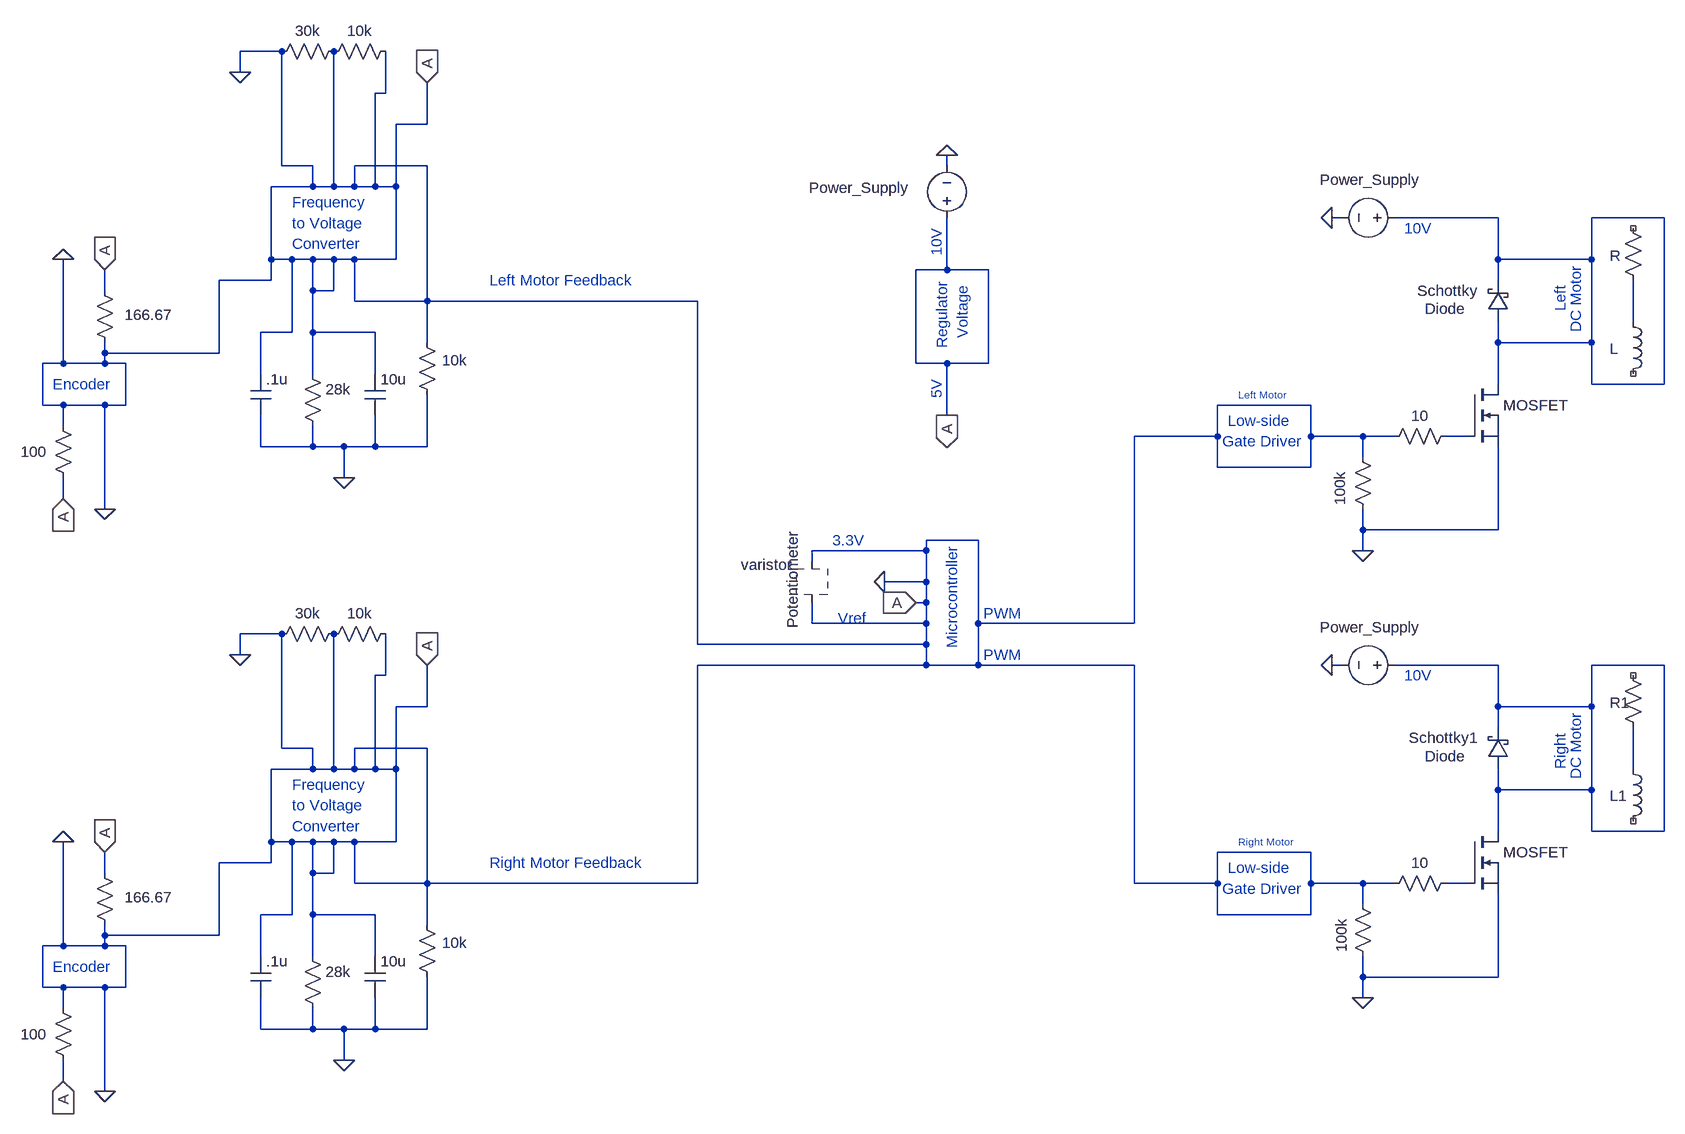
[diagram p0: schematic CircuitDiagram.asc]
CircuitDiagram.asc, the LTspice schematic file:
Version 4
SHEET 1 1300 680
WIRE -944 -1072 -1008 -1072
WIRE -1008 -1040 -1008 -1072
WIRE -784 -1008 -784 -1072
WIRE -784 -1008 -800 -1008
WIRE -720 -960 -720 -1024
WIRE -720 -960 -768 -960
WIRE -944 -896 -944 -1072
WIRE -896 -896 -944 -896
WIRE -720 -896 -832 -896
WIRE 80 -896 80 -912
WIRE -896 -864 -896 -896
WIRE -896 -864 -960 -864
WIRE -864 -864 -864 -1072
WIRE -864 -864 -896 -864
WIRE -832 -864 -832 -896
WIRE -832 -864 -864 -864
WIRE -800 -864 -800 -1008
WIRE -800 -864 -832 -864
WIRE -768 -864 -768 -960
WIRE -768 -864 -800 -864
WIRE 688 -816 672 -816
WIRE 928 -816 768 -816
WIRE 1184 -816 1072 -816
WIRE -960 -752 -960 -864
WIRE -928 -752 -960 -752
WIRE -896 -752 -928 -752
WIRE -864 -752 -896 -752
WIRE -832 -752 -864 -752
WIRE -768 -752 -768 -864
WIRE -768 -752 -832 -752
WIRE 928 -752 928 -816
WIRE 1072 -752 1072 -816
WIRE 1072 -752 928 -752
WIRE 80 -736 80 -816
WIRE 80 -736 32 -736
WIRE 144 -736 80 -736
WIRE -960 -720 -960 -752
WIRE -960 -720 -1040 -720
WIRE 928 -720 928 -752
WIRE -1216 -704 -1216 -736
WIRE -896 -704 -896 -752
WIRE -864 -704 -864 -752
WIRE -864 -704 -896 -704
WIRE -832 -688 -832 -752
WIRE -720 -688 -720 -896
WIRE -720 -688 -832 -688
WIRE -304 -688 -720 -688
WIRE 1136 -656 1136 -720
WIRE -928 -640 -928 -752
WIRE -928 -640 -976 -640
WIRE -896 -640 -896 -704
WIRE -800 -640 -896 -640
WIRE -720 -624 -720 -688
WIRE 928 -624 928 -656
WIRE 1072 -624 1072 -752
WIRE 1072 -624 928 -624
WIRE -1216 -608 -1216 -624
WIRE -1040 -608 -1040 -720
WIRE -1040 -608 -1216 -608
WIRE -1280 -592 -1280 -752
WIRE -1280 -592 -1312 -592
WIRE -1216 -592 -1216 -608
WIRE -1216 -592 -1280 -592
WIRE -1184 -592 -1216 -592
WIRE 32 -592 32 -736
WIRE 80 -592 32 -592
WIRE 144 -592 144 -736
WIRE 144 -592 80 -592
WIRE -976 -576 -976 -640
WIRE -896 -576 -896 -640
WIRE -800 -576 -800 -640
WIRE 928 -560 928 -624
WIRE 1072 -560 1072 -624
WIRE 1184 -560 1184 -816
WIRE 1184 -560 1072 -560
WIRE -1312 -528 -1312 -592
WIRE -1280 -528 -1312 -528
WIRE -1216 -528 -1280 -528
WIRE -1184 -528 -1184 -592
WIRE -1184 -528 -1216 -528
WIRE 640 -528 496 -528
WIRE 80 -512 80 -592
WIRE -1280 -496 -1280 -528
WIRE 496 -480 496 -528
WIRE 496 -480 368 -480
WIRE 640 -480 640 -528
WIRE 720 -480 640 -480
WIRE 768 -480 720 -480
WIRE 880 -480 848 -480
WIRE -976 -464 -976 -512
WIRE -896 -464 -896 -496
WIRE -896 -464 -976 -464
WIRE -848 -464 -896 -464
WIRE -800 -464 -800 -512
WIRE -800 -464 -848 -464
WIRE -720 -464 -720 -544
WIRE -720 -464 -800 -464
WIRE 720 -448 720 -480
WIRE 496 -432 496 -480
WIRE 640 -432 640 -480
WIRE 640 -432 496 -432
WIRE -848 -416 -848 -464
WIRE -1280 -384 -1280 -416
WIRE -1216 -368 -1216 -528
WIRE 720 -336 720 -368
WIRE 928 -336 928 -464
WIRE 928 -336 720 -336
WIRE 128 -320 48 -320
WIRE 48 -304 48 -320
WIRE 48 -304 -128 -304
WIRE 720 -304 720 -336
WIRE -128 -288 -128 -304
WIRE 48 -256 48 -304
WIRE 48 -256 -16 -256
WIRE 48 -224 48 -256
WIRE 48 -224 32 -224
WIRE -128 -192 -128 -224
WIRE 48 -192 48 -224
WIRE 48 -192 -128 -192
WIRE 128 -192 128 -320
WIRE 368 -192 368 -480
WIRE 368 -192 128 -192
WIRE -944 -176 -1008 -176
WIRE -304 -160 -304 -688
WIRE 48 -160 48 -192
WIRE 48 -160 -304 -160
WIRE -1008 -144 -1008 -176
WIRE 48 -128 48 -160
WIRE 48 -128 -304 -128
WIRE 128 -128 128 -192
WIRE 128 -128 48 -128
WIRE 368 -128 128 -128
WIRE 688 -128 672 -128
WIRE 928 -128 768 -128
WIRE 1184 -128 1072 -128
WIRE -784 -112 -784 -176
WIRE -784 -112 -800 -112
WIRE -720 -64 -720 -128
WIRE -720 -64 -768 -64
WIRE 928 -64 928 -128
WIRE 1072 -64 1072 -128
WIRE 1072 -64 928 -64
WIRE 928 -32 928 -64
WIRE -944 0 -944 -176
WIRE -896 0 -944 0
WIRE -720 0 -832 0
WIRE -896 32 -896 0
WIRE -896 32 -960 32
WIRE -864 32 -864 -176
WIRE -864 32 -896 32
WIRE -832 32 -832 0
WIRE -832 32 -864 32
WIRE -800 32 -800 -112
WIRE -800 32 -832 32
WIRE -768 32 -768 -64
WIRE -768 32 -800 32
WIRE 1136 32 1136 -32
WIRE 928 64 928 32
WIRE 1072 64 1072 -64
WIRE 1072 64 928 64
WIRE 928 128 928 64
WIRE 1072 128 1072 64
WIRE 1184 128 1184 -128
WIRE 1184 128 1072 128
WIRE -960 144 -960 32
WIRE -928 144 -960 144
WIRE -896 144 -928 144
WIRE -864 144 -896 144
WIRE -832 144 -864 144
WIRE -768 144 -768 32
WIRE -768 144 -832 144
WIRE 640 160 496 160
WIRE -960 176 -960 144
WIRE -960 176 -1040 176
WIRE -1216 192 -1216 160
WIRE -896 192 -896 144
WIRE -864 192 -864 144
WIRE -864 192 -896 192
WIRE -832 208 -832 144
WIRE -720 208 -720 0
WIRE -720 208 -832 208
WIRE -304 208 -304 -128
WIRE -304 208 -720 208
WIRE 368 208 368 -128
WIRE 496 208 496 160
WIRE 496 208 368 208
WIRE 640 208 640 160
WIRE 720 208 640 208
WIRE 768 208 720 208
WIRE 880 208 848 208
WIRE 720 240 720 208
WIRE -928 256 -928 144
WIRE -928 256 -976 256
WIRE -896 256 -896 192
WIRE -800 256 -896 256
WIRE 496 256 496 208
WIRE 640 256 640 208
WIRE 640 256 496 256
WIRE -720 272 -720 208
WIRE -1216 288 -1216 272
WIRE -1040 288 -1040 176
WIRE -1040 288 -1216 288
WIRE -1280 304 -1280 144
WIRE -1280 304 -1312 304
WIRE -1216 304 -1216 288
WIRE -1216 304 -1280 304
WIRE -1184 304 -1216 304
WIRE -976 320 -976 256
WIRE -896 320 -896 256
WIRE -800 320 -800 256
WIRE 720 352 720 320
WIRE 928 352 928 224
WIRE 928 352 720 352
WIRE -1312 368 -1312 304
WIRE -1280 368 -1312 368
WIRE -1216 368 -1280 368
WIRE -1184 368 -1184 304
WIRE -1184 368 -1216 368
WIRE 720 384 720 352
WIRE -1280 400 -1280 368
WIRE -976 432 -976 384
WIRE -896 432 -896 400
WIRE -896 432 -976 432
WIRE -848 432 -896 432
WIRE -800 432 -800 384
WIRE -800 432 -848 432
WIRE -720 432 -720 352
WIRE -720 432 -800 432
WIRE -848 480 -848 432
WIRE -1280 512 -1280 480
WIRE -1216 528 -1216 368
FLAG -16 -256 0
FLAG 32 -224 A
IOPIN 32 -224 In
FLAG 80 -512 A
IOPIN 80 -512 Out
FLAG 80 -912 0
FLAG 720 -304 0
FLAG 720 384 0
FLAG 672 -816 0
FLAG 672 -128 0
FLAG -1008 -1040 0
FLAG -1216 -368 0
FLAG -1280 -752 0
FLAG -1280 -384 A
IOPIN -1280 -384 In
FLAG -1216 -736 A
IOPIN -1216 -736 In
FLAG -848 -416 0
FLAG -720 -1024 A
IOPIN -720 -1024 In
FLAG -1008 -144 0
FLAG -1216 528 0
FLAG -1280 144 0
FLAG -1280 512 A
IOPIN -1280 512 In
FLAG -1216 160 A
IOPIN -1216 160 In
FLAG -848 480 0
FLAG -720 -128 A
IOPIN -720 -128 In
SYMBOL voltage 80 -800 R180
WINDOW 0 57 62 Left 2
WINDOW 3 24 -5 Left 2
SYMATTR InstName Power_Supply
SYMATTR Value ""
SYMBOL SpecialFunctions\\varistor -144 -192 R180
WINDOW 0 14 -8 VRight 2
SYMATTR InstName Potentiometer
SYMBOL res 704 -464 R0
WINDOW 0 -19 90 VLeft 2
SYMATTR InstName 100k
SYMATTR Value ""
SYMBOL res 864 -496 R90
WINDOW 0 0 56 VBottom 2
WINDOW 3 32 56 VTop 2
SYMATTR InstName 10
SYMATTR Value ""
SYMBOL res 864 192 R90
WINDOW 0 0 56 VBottom 2
WINDOW 3 32 56 VTop 2
SYMATTR InstName 10
SYMATTR Value ""
SYMBOL res 704 224 R0
WINDOW 0 -17 90 VLeft 2
SYMATTR InstName 100k
SYMATTR Value ""
SYMBOL nmos 880 -560 R0
SYMATTR InstName MOSFET
SYMATTR Value ""
SYMBOL nmos 880 128 R0
SYMATTR InstName MOSFET
SYMATTR Value ""
SYMBOL schottky 944 -656 R180
WINDOW 0 48 48 Left 2
WINDOW 3 66 20 Left 2
SYMATTR InstName Schottky
SYMATTR Value Diode
SYMBOL ind 1120 -672 R0
WINDOW 0 -20 57 Left 2
SYMATTR InstName L
SYMATTR Value ""
SYMBOL res 1120 -816 R0
WINDOW 0 -20 58 Left 2
SYMATTR InstName R
SYMATTR Value ""
SYMBOL voltage 784 -816 R90
WINDOW 0 -74 53 VTop 2
WINDOW 3 32 56 VTop 2
SYMATTR InstName Power_Supply
SYMATTR Value ""
SYMBOL schottky 944 32 R180
WINDOW 0 48 48 Left 2
WINDOW 3 66 20 Left 2
SYMATTR InstName Schottky1
SYMATTR Value Diode
SYMBOL ind 1120 16 R0
WINDOW 0 -20 57 Left 2
SYMATTR InstName L1
SYMATTR Value ""
SYMBOL res 1120 -128 R0
WINDOW 0 -20 58 Left 2
SYMATTR InstName R1
SYMATTR Value ""
SYMBOL voltage 784 -128 R90
WINDOW 0 -74 53 VTop 2
WINDOW 3 32 56 VTop 2
SYMATTR InstName Power_Supply
SYMATTR Value ""
SYMBOL res -848 -1088 R90
WINDOW 0 0 56 VBottom 2
WINDOW 3 32 56 VTop 2
SYMATTR InstName 30k
SYMATTR Value ""
SYMBOL res -880 -1056 R270
WINDOW 0 32 56 VTop 2
WINDOW 3 0 56 VBottom 2
SYMATTR InstName 10k
SYMATTR Value ""
SYMBOL res -736 -640 R0
WINDOW 0 39 43 Left 2
SYMATTR InstName 10k
SYMATTR Value ""
SYMBOL res -912 -592 R0
SYMATTR InstName 28k
SYMATTR Value ""
SYMBOL cap -816 -576 R0
SYMATTR InstName 10u
SYMATTR Value ""
SYMBOL cap -992 -576 R0
SYMATTR InstName .1u
SYMATTR Value ""
SYMBOL res -1200 -608 R180
WINDOW 0 -89 59 Left 2
WINDOW 3 36 40 Left 2
SYMATTR InstName 166.67
SYMATTR Value ""
SYMBOL res -1264 -400 R180
WINDOW 0 41 56 Left 2
WINDOW 3 36 40 Left 2
SYMATTR InstName 100
SYMATTR Value ""
SYMBOL res -848 -192 R90
WINDOW 0 0 56 VBottom 2
WINDOW 3 32 56 VTop 2
SYMATTR InstName 30k
SYMATTR Value ""
SYMBOL res -880 -160 R270
WINDOW 0 32 56 VTop 2
WINDOW 3 0 56 VBottom 2
SYMATTR InstName 10k
SYMATTR Value ""
SYMBOL res -736 256 R0
WINDOW 0 39 43 Left 2
SYMATTR InstName 10k
SYMATTR Value ""
SYMBOL res -912 304 R0
SYMATTR InstName 28k
SYMATTR Value ""
SYMBOL cap -816 320 R0
SYMATTR InstName 10u
SYMATTR Value ""
SYMBOL cap -992 320 R0
SYMATTR InstName .1u
SYMATTR Value ""
SYMBOL res -1200 288 R180
WINDOW 0 -89 59 Left 2
WINDOW 3 36 40 Left 2
SYMATTR InstName 166.67
SYMATTR Value ""
SYMBOL res -1264 496 R180
WINDOW 0 41 56 Left 2
WINDOW 3 36 40 Left 2
SYMATTR InstName 100
SYMATTR Value ""
TEXT 88 -312 VRight 2 ;Microcontroller
TEXT 64 -568 VRight 2 ;5V
TEXT 104 -712 VRight 2 ;Voltage
TEXT 72 -720 VRight 2 ;Regulator
TEXT 64 -800 VRight 2 ;10V
TEXT -96 -320 Left 2 ;3.3V
TEXT 136 -208 Left 2 ;PWM
TEXT 136 -144 Left 2 ;PWM
TEXT 512 -504 Left 2 ;Low-side
TEXT 504 -472 Left 2 ;Gate Driver
TEXT 528 -544 Left 1 ;Left Motor
TEXT 512 184 Left 2 ;Low-side
TEXT 504 216 Left 2 ;Gate Driver
TEXT 528 144 Left 1 ;Right Motor
TEXT -88 -200 Left 2 ;Vref
TEXT 784 -800 Left 2 ;10V
TEXT 1048 -640 VLeft 2 ;DC Motor
TEXT 784 -112 Left 2 ;10V
TEXT 1048 48 VLeft 2 ;DC Motor
TEXT 1024 32 VLeft 2 ;Right
TEXT 1024 -672 VLeft 2 ;Left
TEXT -1296 -560 Left 2 ;Encoder
TEXT -928 -840 Left 2 ;Frequency
TEXT -928 -808 Left 2 ;to Voltage
TEXT -928 -776 Left 2 ;Converter
TEXT -624 -720 Left 2 ;Left Motor Feedback
TEXT -1296 336 Left 2 ;Encoder
TEXT -928 56 Left 2 ;Frequency
TEXT -928 88 Left 2 ;to Voltage
TEXT -928 120 Left 2 ;Converter
TEXT -624 176 Left 2 ;Right Motor Feedback

The netlist it stands for:
* CircuitDiagram.asc
V§Power_Supply 0 0
* Potentiometer: varistor (symbol SpecialFunctions\varistor not available, pin order unknown); nets seen at it: 0
R§100k 0 0
R§10 N003 0
R§10 N006 0
R§100k 0 0
MOSFET N001 N003 0 0
MOSFET N004 N006 0 0
D§Schottky N001 N001 Diode
L N002 NC_01
R NC_02 N002
V§Power_Supply N001 0
D§Schottky1 N004 N004 Diode
L1 N005 NC_03
R1 NC_04 N005
V§Power_Supply N004 0
R§30k 0 0
R§10k 0 0
R§10k 0 0
R§28k 0 0
C§10u 0 0
C§.1u 0 0
R§166.67 0 0
R§100 0 0
R§30k 0 0
R§10k 0 0
R§10k 0 0
R§28k 0 0
C§10u 0 0
C§.1u 0 0
R§166.67 0 0
R§100 0 0
.model D D
.lib standard.dio
.model NMOS NMOS
.model PMOS PMOS
.lib standard.mos
* Microcontroller
* 5V
* Voltage
* Regulator
* 10V
* 3.3V
* PWM
* PWM
* Low-side
* Gate Driver
* Left Motor
* Low-side
* Gate Driver
* Right Motor
* Vref
* 10V
* DC Motor
* 10V
* DC Motor
* Right
* Left
* Encoder
* Frequency
* to Voltage
* Converter
* Left Motor Feedback
* Encoder
* Frequency
* to Voltage
* Converter
* Right Motor Feedback
.backanno
.end